# EAGLE design Controller - ESP32 Wroom - Rev. A (EAGLE 9.6.2)
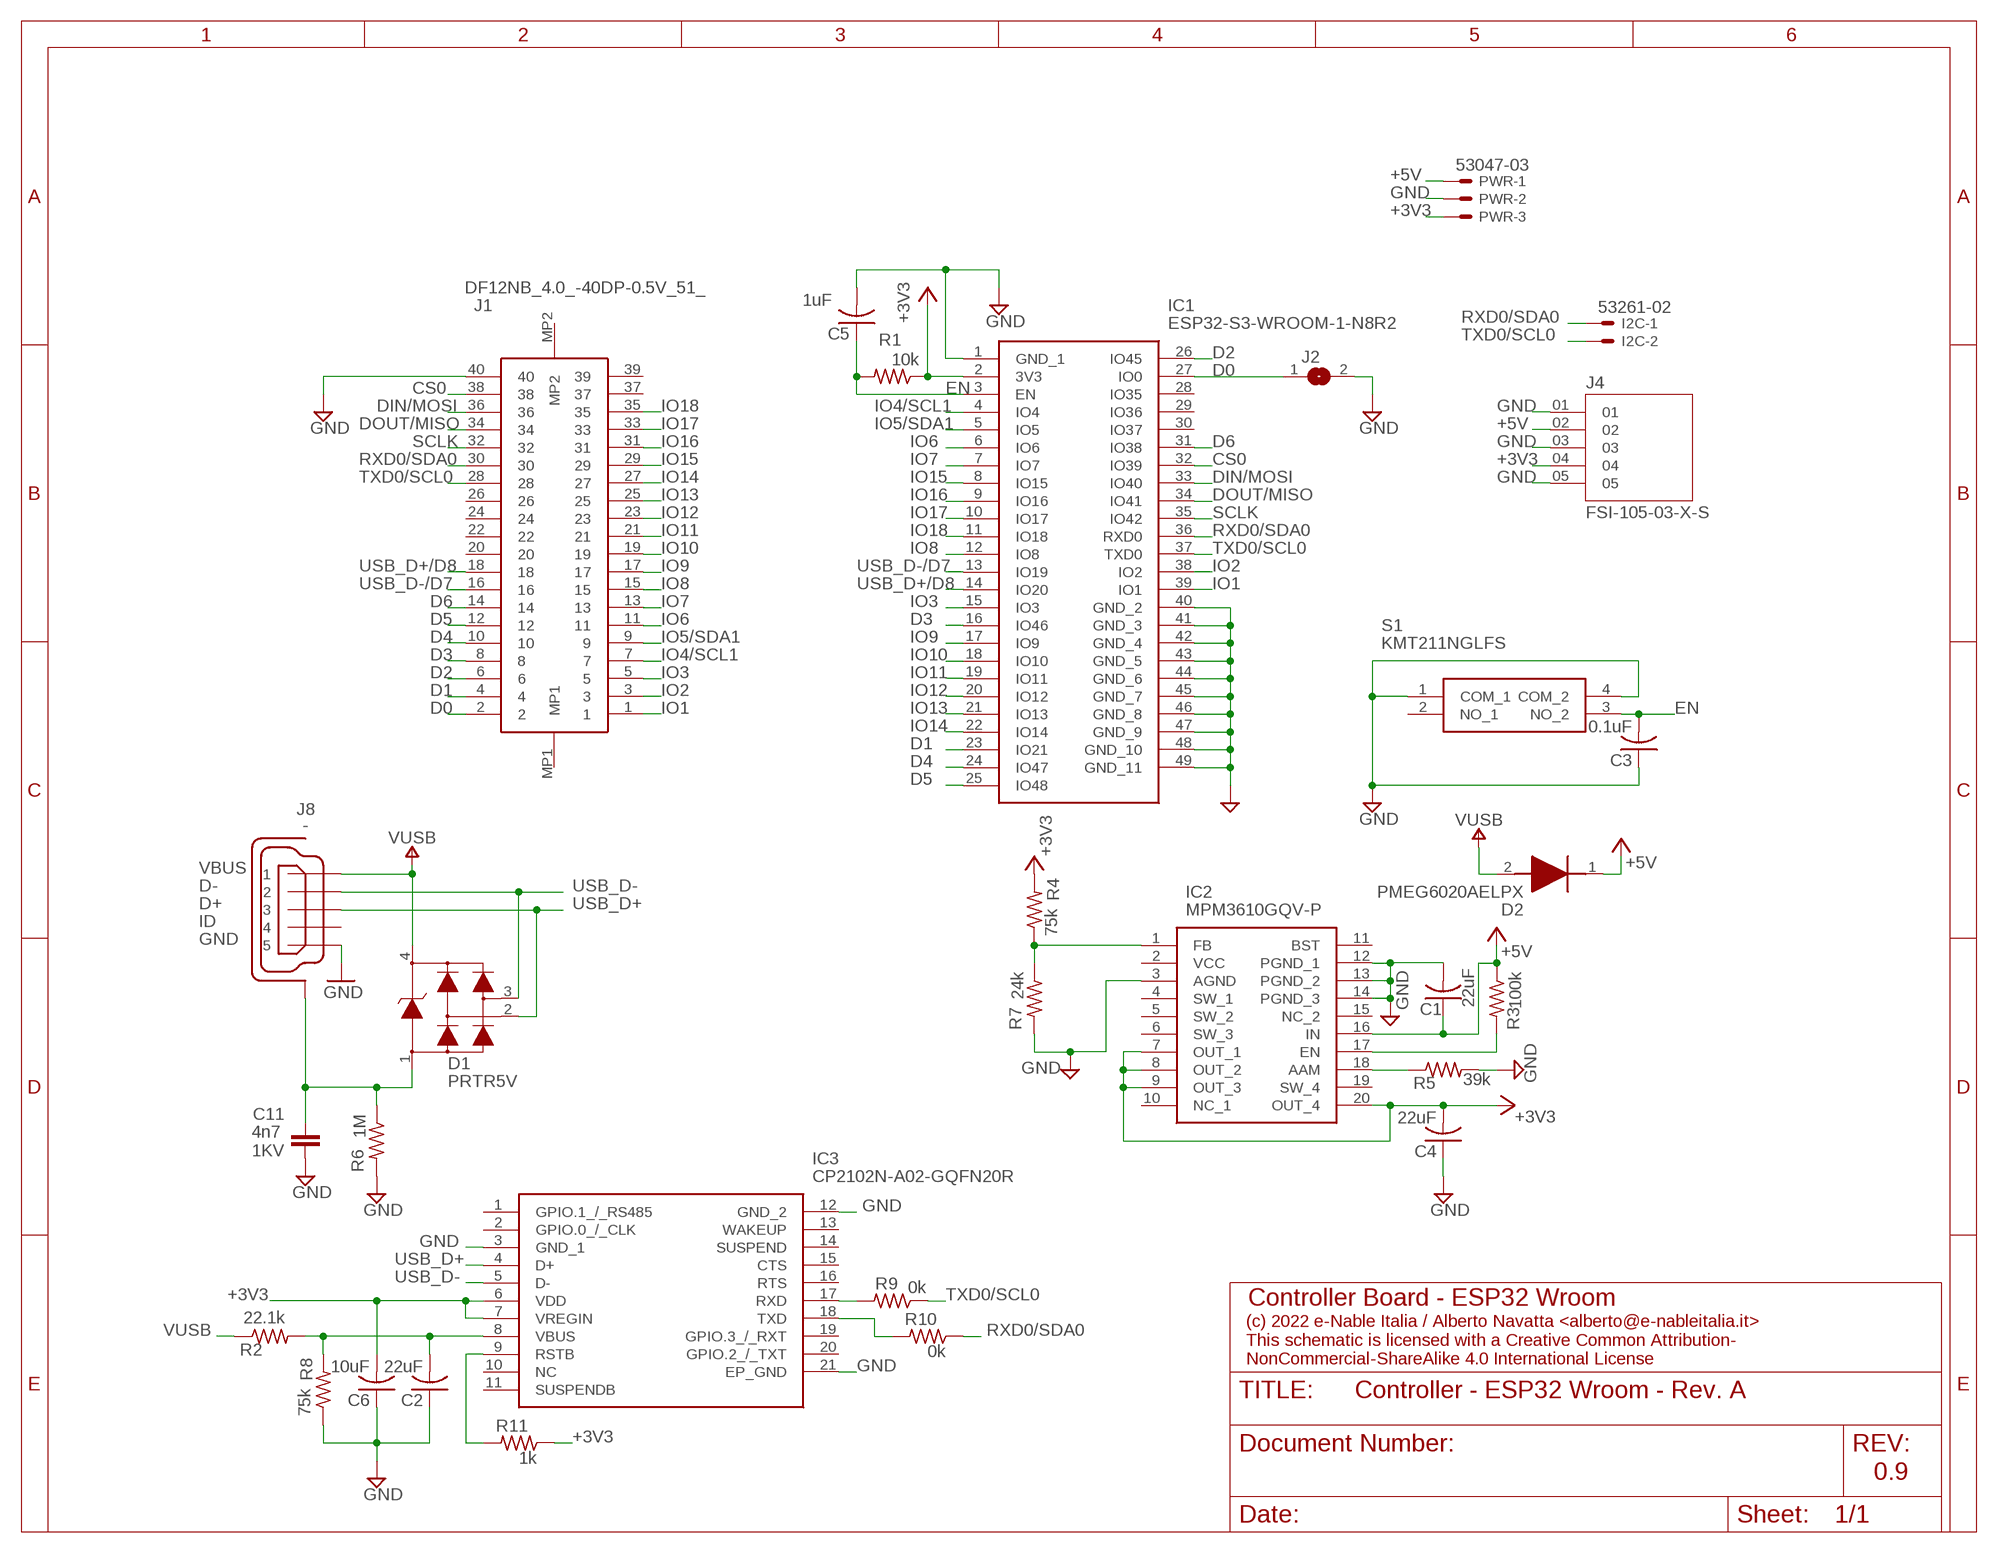
[diagram p0: schematic, sheet 1]

## Parts
C1  22uF  C-USC0603  [C0603]
C2  22uF  C-USC0402  [C0402]
C3  0.1uF  C-USC0402  [C0402]
C4  22uF  C-USC0603  [C0603]
C5  1uF  C-USC0402  [C0402]
C6  10uF  C-USC0402  [C0402]
C11  4n7  C4.7NF-0805  [0805-R2013X50N]
D1  PRTR5V  PRTR5V0U2X,215  [SOT190P230X110-4N]
D2  PMEG6020AELPX  [SODFL4725X110N]
I2C  53261-02  [53261-02]
IC1  ESP32-S3-WROOM-1-N8R2  [ESP32S3WROOM1N8R2]
IC2  MPM3610GQV-P  [MPM3610GQVP]
IC3  CP2102N-A02-GQFN20R  [CP2102NA02GQFN20]
J1  DF12NB_4.0_-40DP-0.5V_51_  [DF12NB4040DP05V51]
J2  SJ  [SJ]
J4  FSI-105-03-X-S  [SAMTEC_FSI-105-03-X-S]
J8  -  USB-MICRO  [ZX62-AB-5PA]
PWR  53047-03  [53047-03]
R1  10k  R-US_R0402  [R0402]
R2  22.1k  R-US_R0402  [R0402]
R3  100k  R-US_R0402  [R0402]
R4  75k  R-US_R0402  [R0402]
R5  39k  R-US_R0402  [R0402]
R6  1M  R-US_R0402  [R0402]
R7  24k  R-US_R0402  [R0402]
R8  75k  R-US_R0402  [R0402]
R9  0k  R-US_R0402  [R0402]
R10  0k  R-US_R0402  [R0402]
R11  1k  R-US_R0402  [R0402]
S1  KMT211NGLFS  [KMT211NGLFS]

## Nets
+3V3 [Power]: C4.2 C6.2 IC1.2(3V3) IC2.7(OUT_1) IC2.8(OUT_2) IC2.9(OUT_3) IC2.20(OUT_4) IC3.6(VDD) IC3.7(VREGIN) J4.04 PWR.3 R1.1 R4.2 R11.1
+5V [Power]: C1.1 D2.1(K) IC2.16(IN) J4.02 PWR.1 R3.1
CS0: IC1.32(IO39) J1.38
D0: IC1.27(IO0) J1.2 J2.1
D1: IC1.23(IO21) J1.4
D2: IC1.26(IO45) J1.6
D3: IC1.16(IO46) J1.8
D4: IC1.24(IO47) J1.10
D5: IC1.25(IO48) J1.12
D6: IC1.31(IO38) J1.14
DIN/MOSI: IC1.33(IO40) J1.36
DOUT/MISO: IC1.34(IO41) J1.34
EN: C3.2 C5.1 IC1.3(EN) R1.2 S1.3(NO_2)
GND [GND]: C1.2 C2.1 C3.1 C4.1 C5.2 C6.1 C11.2 IC1.1(GND_1) IC1.40(GND_2) IC1.41(GND_3) IC1.42(GND_4) IC1.43(GND_5) IC1.44(GND_6) IC1.45(GND_7) IC1.46(GND_8) IC1.47(GND_9) IC1.48(GND_10) IC1.49(GND_11) IC2.3(AGND) IC2.12(PGND_1) IC2.13(PGND_2) IC2.14(PGND_3) IC3.3(GND_1) IC3.12(GND_2) IC3.21(EP_GND) J1.40 J2.2 J4.01 J4.03 J4.05 J8.5 PWR.2 R5.2 R6.2 R7.2 R8.1 S1.1(COM_1) S1.4(COM_2)
IO1: IC1.39(IO1) J1.1
IO2: IC1.38(IO2) J1.3
IO3: IC1.15(IO3) J1.5
IO4/SCL1: IC1.4(IO4) J1.7
IO5/SDA1: IC1.5(IO5) J1.9
IO6: IC1.6(IO6) J1.11
IO7: IC1.7(IO7) J1.13
IO8: IC1.12(IO8) J1.15
IO9: IC1.17(IO9) J1.17
IO10: IC1.18(IO10) J1.19
IO11: IC1.19(IO11) J1.21
IO12: IC1.20(IO12) J1.23
IO13: IC1.21(IO13) J1.25
IO14: IC1.22(IO14) J1.27
IO15: IC1.8(IO15) J1.29
IO16: IC1.9(IO16) J1.31
IO17: IC1.10(IO17) J1.33
IO18: IC1.11(IO18) J1.35
N$1: IC2.18(AAM) R5.1
N$2: C2.2 IC3.8(VBUS) R2.2 R8.2
N$3: IC2.1(FB) R4.1 R7.1
N$4: IC2.17(EN) R3.2
N$5: IC3.17(RXD) R9.2
N$6: IC3.18(TXD) R10.2
N$7: C11.1 D1.1 J8.6(SH) J8.7(SH) J8.8(SH) J8.9(SH) J8.10(SH) J8.11(SH) R6.1
N$8: IC3.9(RSTB) R11.2
RXD0/SDA0: I2C.1 IC1.36(RXD0) J1.30 R10.1
SCLK: IC1.35(IO42) J1.32
TXD0/SCL0: I2C.2 IC1.37(TXD0) J1.28 R9.1
USB_D+: D1.2 IC3.4(D+) J8.3
USB_D+/D8: IC1.14(IO20) J1.18
USB_D-: D1.3 IC3.5(D-) J8.2
USB_D-/D7: IC1.13(IO19) J1.16
VUSB [Power]: D1.4 D2.2(A) J8.1 R2.1
Unconnected: IC1.28(IO35) IC1.29(IO36) IC1.30(IO37) IC2.2(VCC) IC2.4(SW_1) IC2.5(SW_2) IC2.6(SW_3) IC2.10(NC_1) IC2.11(BST) IC2.15(NC_2) IC2.19(SW_4) IC3.1(GPIO.1_/_RS485) IC3.2(GPIO.0_/_CLK) IC3.10(NC) IC3.11(SUSPENDB) IC3.13(WAKEUP) IC3.14(SUSPEND) IC3.15(CTS) IC3.16(RTS) IC3.19(GPIO.3_/_RXT) IC3.20(GPIO.2_/_TXT) J1.20 J1.22 J1.24 J1.26 J1.37 J1.39 J1.MP1 J1.MP2 J8.4 S1.2(NO_1)

## Notes on the sheet
- Controller Board - ESP32 Wroom
- (c) 2022 e-Nable Italia / Alberto Navatta <alberto@e-nableitalia.it>
  This schematic is licensed with a Creative Common Attribution-
  NonCommercial-ShareAlike 4.0 International License
- 0.9

## Library data of the parts
C1-C6 = rcl:C-US: CAPACITOR, American symbol; SPICEPREFIX: C
C11 = Arduino-rcl:C: SMD Capacitor; CODE-ARDUINO: 0689; DATASHEET: http://www.kemet.com/Lists/ProductCatalog/Attachments/40/KEM_C1010_X7R_HV_SMD.pdf; DISTRIBUTOR-LINK: www.kemet.com/docfinder?Partnumber=C0805C472KDRACTU; DISTRIBUTOR-PN: 399-6738-1-ND; MANUFACTURER: Kemet; MANUFACTURER-PN: C0805C472KDRACTU; NOTE: -; VOLTAGE: 1KV
D1 = Arduino-diodes:PRTR5V0U2X,215: USB ESD protection; CODE-ARDUINO: 2209; DATASHEET: http://www.nxp.com/documents/data_sheet/PRTR5V0U2X.pdf; DISTRIBUTOR-LINK: http://www.digikey.com/product-detail/en/nxp-semiconductors/PRTR5V0U2X,215/568-4140-1-ND/1589981; DISTRIBUTOR-PN: 568-4140-1-ND; MANUFACTURER: NXP; MANUFACTURER-PN: PRTR5V0U2X,215
D2 = SamacSys_Parts:PMEG6020AELPX: NEXPERIA - PMEG6020AELPX - Schottky Rectifier, 60 V, 2 A, Single, SOD-128, 2 Pins, 670 mV Source: Datasheet <https://ms.componentsearchengine.com/Datasheets/2/PMEG6020AELPX.pdf>; DESCRIPTION: NEXPERIA - PMEG6020AELPX - Schottky Rectifier, 60 V, 2 A, Single, SOD-128, 2 Pins, 670 mV; HEIGHT: 1.1mm; MANUFACTURER_NAME: Nexperia; MANUFACTURER_PART_NUMBER: PMEG6020AELPX; MOUSER_PART_NUMBER: 771-PMEG6020AELPX; MOUSER_PRICE-STOCK: https://www.mouser.co.uk/ProductDetail/Nexperia/PMEG6020AELPX?qs=bel5lzaZNxQeOe%2FrOz5yeQ%3D%3D
I2C = con-molex:53?-02: CONNECTOR wire to board 1.25 mm (.049 inch) pitch header; MF: MOLEX; OC_FARNELL: 1125373; OC_NEWARK: unknown
IC1 = SamacSys_Parts:ESP32-S3-WROOM-1-N8R2: WiFi Modules - 802.11 (Engineering Samples Only) SMD Module, ESP32-S3R2, 2 MB PSRAM, 8 MB SPI Flash, PCB Antenna ,, Source: Datasheet; DESCRIPTION: WiFi Modules - 802.11 (Engineering Samples Only) SMD Module, ESP32-S3R2, 2 MB PSRAM, 8 MB SPI Flash, PCB Antenna ,,; HEIGHT: 3.25mm; MANUFACTURER_NAME: Espressif Systems; MANUFACTURER_PART_NUMBER: ESP32-S3-WROOM-1-N8R2; MOUSER_PART_NUMBER: 356-ESP32-S3WRM1N8R2; MOUSER_PRICE-STOCK: https://www.mouser.co.uk/ProductDetail/Espressif-Systems/ESP32-S3-WROOM-1-N8R2?qs=Wj%2FVkw3K%252BMCC1Ha9x85iJA%3D%3D
IC2 = SamacSys_Parts:MPM3610GQV-P: Switching Voltage Regulators 24V/1A DC/DC Mini- Module Reg w Inductr Source: Datasheet <https://componentsearchengine.com/Datasheets/1/MPM3610GQV-P.pdf>; DESCRIPTION: Switching Voltage Regulators 24V/1A DC/DC Mini- Module Reg w Inductr; HEIGHT: 1.65mm; MANUFACTURER_NAME: Monolithic Power Systems (MPS); MANUFACTURER_PART_NUMBER: MPM3610GQV-P; MOUSER_PART_NUMBER: 946-MPM3610GQV-P; MOUSER_PRICE-STOCK: https://www.mouser.co.uk/ProductDetail/Monolithic-Power-Systems-MPS/MPM3610GQV-P?qs=uA8e7uFv8Fj%2FtQLBFM6HcA%3D%3D
IC3 = SamacSys_Parts:CP2102N-A02-GQFN20R: Full Speed USB to UART Bridge USB 2.0 3.3V T/R Automotive 20-Pin QFN EP Source: Datasheet <https://www.silabs.com/documents/public/data-sheets/cp2102n-datasheet.pdf>; DESCRIPTION: Full Speed USB to UART Bridge USB 2.0 3.3V T/R Automotive 20-Pin QFN EP; HEIGHT: 0.8mm; MANUFACTURER_NAME: Silicon Labs; MANUFACTURER_PART_NUMBER: CP2102N-A02-GQFN20R; MOUSER_PART_NUMBER: 634-CP2102NA02QFN20R; MOUSER_PRICE-STOCK: https://www.mouser.co.uk/ProductDetail/Silicon-Labs/CP2102N-A02-GQFN20R?qs=u16ybLDytRbf2uwPkMBdUg%3D%3D
J1 = SamacSys_Parts:DF12NB_4.0_-40DP-0.5V_51_: Board to!! Board !! & Mezzanine Connectors CONN HDR 40POS SMD G Source: Datasheet <https://www.hirose.com/en/product/document?clcode=CL0537-0596-0-51&productname=DF12NB(4.0)-40DP-0.5V(51)&series=DF12N&documenttype=2DDrawing&lang=en&documentid=0001367371>; DESCRIPTION: Board to!! Board !! & Mezzanine Connectors CONN HDR 40POS SMD G; HEIGHT: 3.5mm; MANUFACTURER_NAME: Hirose; MANUFACTURER_PART_NUMBER: DF12NB(4.0)-40DP-0.5V(51); MOUSER_PART_NUMBER: 798-DF12NB4040DP0551; MOUSER_PRICE-STOCK: https://www.mouser.co.uk/ProductDetail/Hirose-Connector/DF12NB4.0-40DP-0.5V51?qs=DPoM0jnrROUKZpllIjGjYw%3D%3D
J2 = jumper:SJ: SMD solder JUMPER
J4 = FSI-105-03-X-S:FSI-105-03-X-S: 1mm SINGLE ELEMENT INTERFACE Check availability <https://pricing.snapeda.com/parts/FSI-105-03-G-S/Samtec/view-part?ref=eda>; AVAILABILITY: In Stock; DESCRIPTION: 5 Position Connector Stacking Compression Surface Mount Gold; MF: Samtec; MP: FSI-105-03-G-S; PACKAGE: None; PRICE: None; PURCHASE-URL: https://pricing.snapeda.com/search/part/FSI-105-03-G-S/?ref=eda
J8 = Arduino-connectors:USB-MICRO: USB - micro AB USB 2.0 Receptacle Connector 5 Position Surface Mount, Right Angle, Horizontal; CODE-ARDUINO: 2219; DATASHEET: https://www.hirose.com/product/en/download_file/key_name/ZX/category/Catalog/doc_file_id/31704/?file_category_id=4&item_id=13&is_series=1; DISTRIBUTOR-LINK: http://www.digikey.com/product-detail/en/hirose-electric-co-ltd/ZX62-AB-5PA(31)/H125279CT-ND/5994741; DISTRIBUTOR-PN: H125279CT-ND; MANUFACTURER: Hirose; MANUFACTURER-PN: ZX62-AB-5PA(31)
PWR = con-molex:53?-03: CONNECTOR wire to board 1.25 mm (.049 inch) pitch header; MF: MOLEX; MPN: 530470310; OC_FARNELL: 9732853; OC_NEWARK: 14R5412
R1-R11 = rcl:R-US_: RESISTOR, American symbol; SPICEPREFIX: R
S1 = SamacSys_Parts:KMT211NGLFS: Tactile Switches SPST N.O. GULLWING FOR SMT Source: Datasheet <https://www.ckswitches.com/media/1455/kmt2.pdf>; DESCRIPTION: Tactile Switches SPST N.O. GULLWING FOR SMT; HEIGHT: 0.8mm; MANUFACTURER_NAME: C & K COMPONENTS; MANUFACTURER_PART_NUMBER: KMT211NGLFS; MOUSER_PART_NUMBER: 611-KMT211NGLFS; MOUSER_PRICE-STOCK: https://www.mouser.co.uk/ProductDetail/CK/KMT211NGLFS?qs=hvk6vzacGVhmRxqfjOQwQg%3D%3D

## Net classes
2 Power: width 0.203 mm

## Board
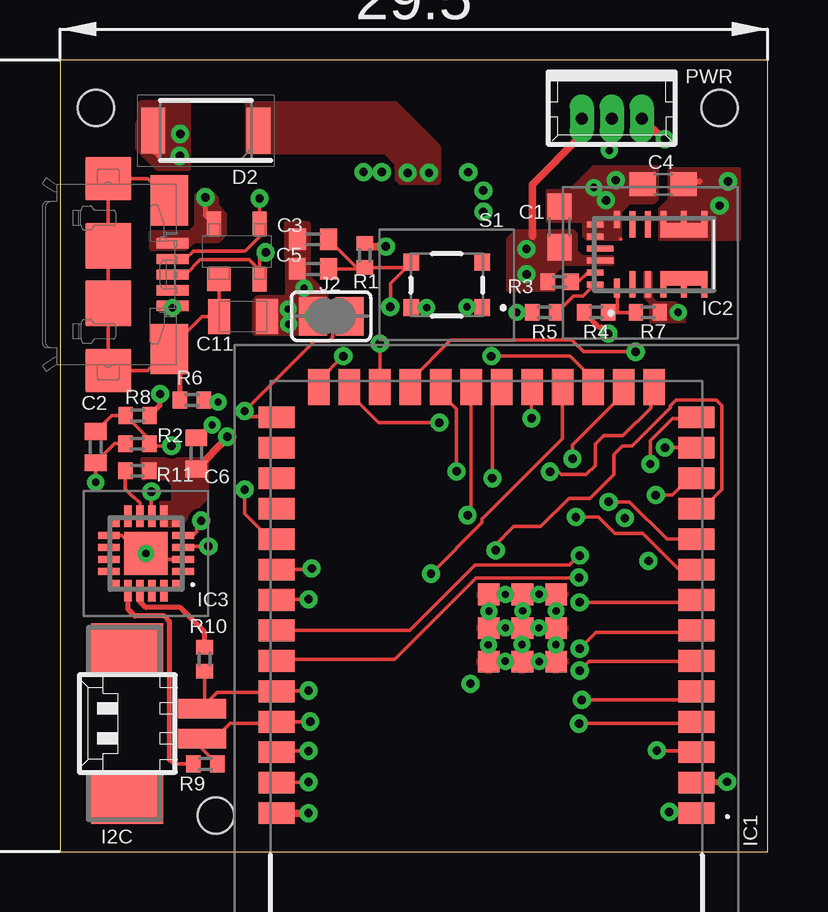
[diagram p1: board, top side]
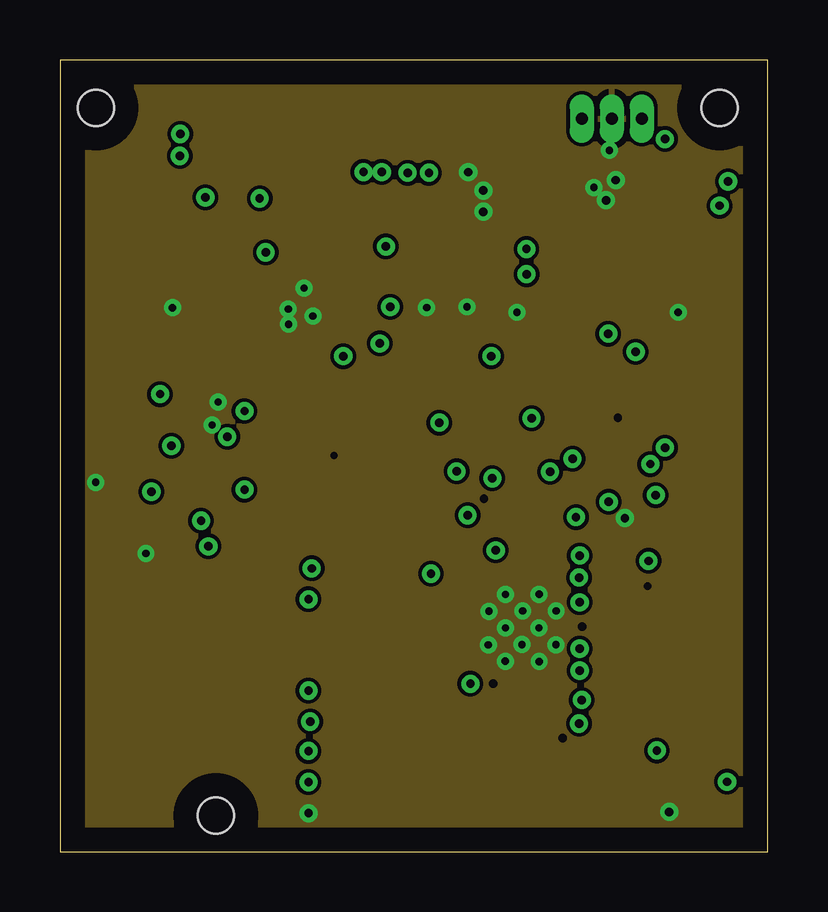
[diagram p2: board, inner layer Route2]
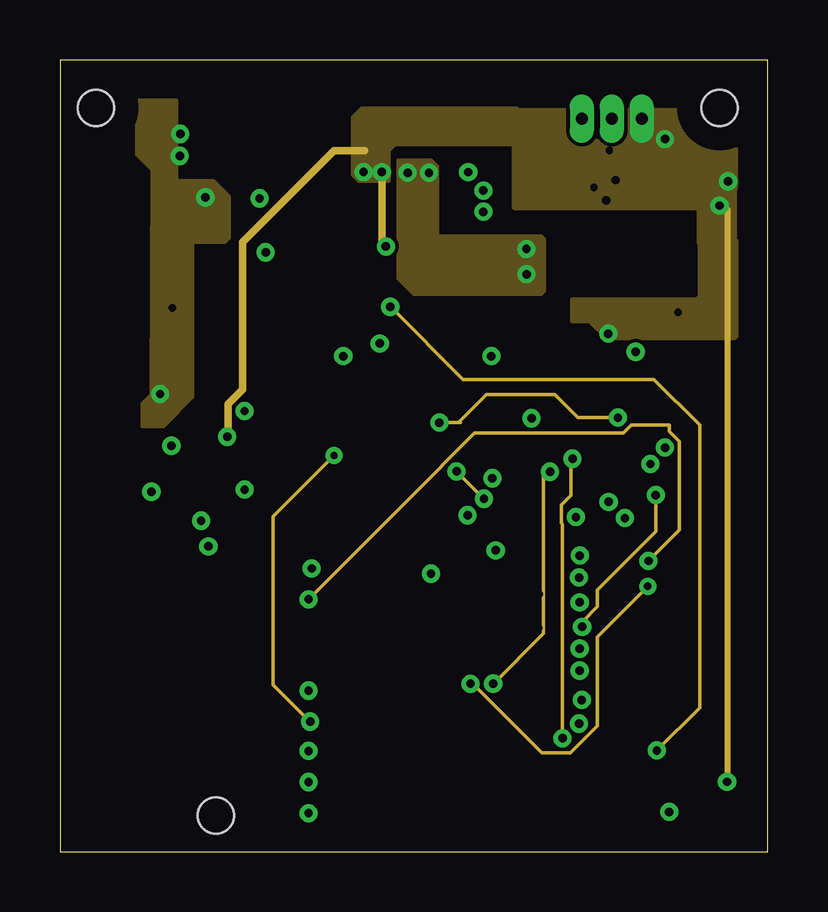
[diagram p3: board, inner layer Route15]
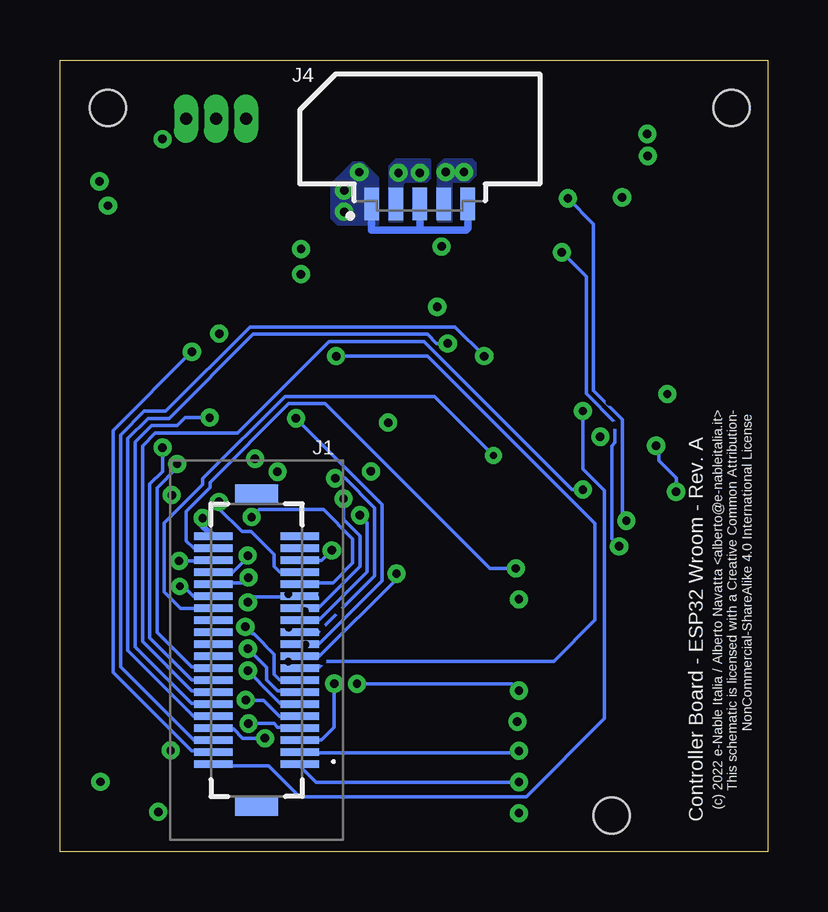
[diagram p4: board, bottom side, seen from below]

Size 29.5 x 33 mm. Coordinates in mm from the lower left corner, seen from the top.
Outline: 0,0 29.5,0 29.5,33 0,33 0,0
Copper layers ([2:1+(2*15)+16:15]): Top 0.035mm / dielectric 0.11mm / Route2 0.035mm / dielectric 0.8mm / Route15 0.035mm / dielectric 0.11mm / Bottom 0.035mm
Design rules "default *": minimum track width 6mil, minimum drill 0.35mm, track to track 6mil, track to pad 6mil, pad to pad 6mil, via to via 6mil, smd to smd 6mil, copper to edge 40mil, drill to drill 6mil, minimum pad ring 10mil, minimum via ring 8mil, stop-mask expansion 4mil, vias tented up to drill 0mil, thermal gap 10mil
Holes 1.5 mm at 1.5,31 27.5,31 6.5,1.5

### Footprints (pad centres in the part's own frame; a part is rotated, then mirrored left to right if it is on the bottom)
C0603 = smd 1.1 x 1: 1 -0.85,0; 2 0.85,0
C0402 = smd 0.7 x 0.9: 1 -0.65,0; 2 0.65,0
0805-R2013X50N = smd 0.95 x 1.45: 1 -1,0; 2 1,0
SOT190P230X110-4N = smd 1 x 1: 1 -1.15,0.75 | smd 1 x 0.6: 2 -1.15,-0.95; 3 1.15,-0.95; 4 1.15,0.95
SODFL4725X110N = smd 1 x 1.93: 1 -2.2,0; 2 2.2,0
53261-02 = smd 0.8 x 2: 1 0.625,-2.5; 2 -0.625,-2.5 | smd 2.1 x 3: S1 3.125,0.625; S2 -3.125,0.625
ESP32S3WROOM1N8R2 = smd 1.5 x 0.9: 1 -8.75,5.26; 2 -8.75,3.99; 3 -8.75,2.72; 4 -8.75,1.45; 5 -8.75,0.18; 6 -8.75,-1.09; 7 -8.75,-2.36; 8 -8.75,-3.63; 9 -8.75,-4.9; 10 -8.75,-6.17; 11 -8.75,-7.44; 12 -8.75,-8.71; 13 -8.75,-9.98; 14 -8.75,-11.25; 27 8.75,-11.25; 28 8.75,-9.98; 29 8.75,-8.71; 30 8.75,-7.44; 31 8.75,-6.17; 32 8.75,-4.9; 33 8.75,-3.63; 34 8.75,-2.36; 35 8.75,-1.09; 36 8.75,0.18; 37 8.75,1.45; 38 8.75,2.72; 39 8.75,3.99; 40 8.75,5.26 | smd 0.9 x 1.5: 15 -6.985,-12.5; 16 -5.715,-12.5; 17 -4.445,-12.5; 18 -3.175,-12.5; 19 -1.905,-12.5; 20 -0.635,-12.5; 21 0.635,-12.5; 22 1.905,-12.5; 23 3.175,-12.5; 24 4.445,-12.5; 25 5.715,-12.5; 26 6.985,-12.5 | smd 0.9 x 0.9: 41 -1.5,-2.46; 42 -1.5,-1.06; 43 -2.9,-1.06; 44 -2.9,-2.46; 45 -2.9,-3.86; 46 -1.5,-3.86; 47 -0.1,-3.86; 48 -0.1,-2.46; 49 -0.1,-1.06
MPM3610GQVP = smd 0.8 x 0.25: 1 -1.4,1.55 | smd 1.1 x 0.25: 2 -1.25,0.9; 3 -1.25,0.25; 10 1.25,0.25; 11 1.25,0.9 | smd 0.5 x 0.25: 4 -1.55,-0.4; 5 -1.55,-1.25; 6 -1.55,-2.1; 7 1.55,-2.1; 8 1.55,-1.25; 9 1.55,-0.4 | smd 0.7 x 0.25: 12 1.45,1.55 | smd 0.25 x 0.7: 13 1.25,2.45; 14 0.75,2.45; 17 -0.75,2.45; 18 -1.25,2.45 | smd 0.25 x 1.1: 15 0.25,2.25; 16 -0.25,2.25 | smd 0.6 x 1.95: 19 -1,-1.25; 20 1,-1.25
CP2102NA02GQFN20 = smd 0.3 x 0.3: 1 -1.25,1.25; 6 -1.25,-1.25; 11 1.25,-1.25; 16 1.25,1.25 | smd 0.9 x 0.3: 2 -1.55,0.75; 3 -1.55,0.25; 4 -1.55,-0.25; 5 -1.55,-0.75; 12 1.55,-0.75; 13 1.55,-0.25; 14 1.55,0.25; 15 1.55,0.75 | smd 0.3 x 0.9: 7 -0.75,-1.55; 8 -0.25,-1.55; 9 0.25,-1.55; 10 0.75,-1.55; 17 0.75,1.55; 18 0.25,1.55; 19 -0.25,1.55; 20 -0.75,1.55 | smd 1.8 x 1.8: 21 0,0
DF12NB4040DP05V51 = smd 0.3 x 1.6: 1 -4.75,-1.8; 2 -4.75,1.8; 3 -4.25,-1.8; 4 -4.25,1.8; 5 -3.75,-1.8; 6 -3.75,1.8; 7 -3.25,-1.8; 8 -3.25,1.8; 9 -2.75,-1.8; 10 -2.75,1.8; 11 -2.25,-1.8; 12 -2.25,1.8; 13 -1.75,-1.8; 14 -1.75,1.8; 15 -1.25,-1.8; 16 -1.25,1.8; 17 -0.75,-1.8; 18 -0.75,1.8; 19 -0.25,-1.8; 20 -0.25,1.8; 21 0.25,-1.8; 22 0.25,1.8; 23 0.75,-1.8; 24 0.75,1.8; 25 1.25,-1.8; 26 1.25,1.8; 27 1.75,-1.8; 28 1.75,1.8; 29 2.25,-1.8; 30 2.25,1.8; 31 2.75,-1.8; 32 2.75,1.8; 33 3.25,-1.8; 34 3.25,1.8; 35 3.75,-1.8; 36 3.75,1.8; 37 4.25,-1.8; 38 4.25,1.8; 39 4.75,-1.8; 40 4.75,1.8 | smd 0.8 x 1.8: MP1 -6.5,0; MP2 6.5,0
SJ = smd 1.168 x 1.6: 1 -0.762,0; 2 0.762,0
SAMTEC_FSI-105-03-X-S = smd 0.6 x 1.35: 01 -2,0; 02 -1,0; 03 0,0; 04 1,0; 05 2,0
ZX62-AB-5PA = smd 0.4 x 1.35: 1 -1.3,3.025; 2 -0.65,3.025; 3 0,3.025; 4 0.65,3.025; 5 1.3,3.025 | smd 2.1 x 1.6: 6 3.1,2.9; 11 -3.1,2.9 | smd 1.8 x 1.9: 7 4,0.35; 10 -4,0.35 | smd 1.9 x 1.9: 8 1.2,0.35; 9 -1.2,0.35
53047-03 = drill 0.5 pad 0.698 long: 1 1.25,0.45; 2 0,0.45; 3 -1.25,0.45
R0402 = smd 0.6 x 0.7: 1 -0.5,0; 2 0.5,0
KMT211NGLFS = smd 0.65 x 0.7: 1 -1.475,0.95; 2 -1.475,-0.95; 3 1.475,-0.95; 4 1.475,0.95

### Placement (x,y rotation side)
C1  20.83,26.04 90 top
C2  1.49,16.86 90 top
C3  10.55,25.52 0 top
C4  25.15,27.81 0 top
C5  10.55,24.28 180 top
C6  5.69,16.6 270 top
C11  7.63,22.3 0 top
D1  7.38,25.01 90 top
D2  6.08,30.05 180 top
I2C  3.43,5.33 90 top
IC1  17.78,6.86 180 top
IC2  24.77,24.89 90 top
IC3  3.58,12.43 180 top
J1  21.3,8.4 90 bottom
J2  11.31,22.32 180 top
J4  14.5,27 0 bottom
J8  1.67,24.05 270 top
PWR  23,31 180 top
R1  12.71,24.85 270 top
R2  3.24,18.17 180 top
R3  20.83,23.75 0 top
R4  22.35,22.48 180 top
R5  20.19,22.48 180 top
R6  5.51,18.83 0 top
R7  24.51,22.48 0 top
R8  3.22,17 0 top
R9  6.06,3.65 180 top
R10  6.03,8.02 90 top
R11  3.23,15.88 180 top
S1  16.13,23.62 180 top

### Tracks (layer width: path | path; a pad name or v marks a point on that pad's centre or on a via)
+3V3  (via drill 0.35, 0.35 pad 0.18)
  Top 0.203: 26.52,2.9 IC1.2 | v22.86,21.59 22.57,21.88 22.45,21.88 22.3,22.02 22.3,22.03 R4.2
  Top 0.254: IC1.2 26.57,2.91 v27.82,2.91 | C4.2 26.12,27.94 26.67,27.94
  Top 0.305: 12.87,25.51 R1.1 12.84,25.23 v13.59,25.23 | PWR.3 25.18,29.7 v25.22,29.7 | v6.97,17.3 6.97,17.23 C6.2
  Route15 0.254: 27.81,26.8 v27.81,2.91 v27.82,2.91
  Route15 0.305: v6.97,17.3 7.01,17.34 7.01,18.65 7.62,19.25 7.62,25.4 11.43,29.21 12.7,29.21 | v13.42,28.33 13.42,25.4 v13.59,25.23
  other vias: 27.85,27.94 27.5,26.93 12.66,28.33
  pour Top (no thermals): 25.4,28.45 25.4,27.18 25.02,26.8 25.02,25.53 28.32,25.53 28.32,28.45
  pour Route15 (no thermals): 18.96,30.91 27.57,30.91 28.16,30.32 28.16,27.65 27.34,26.83 18.96,26.83
  pour Route15 (no thermals): 26.67,27.94 28.1,27.94 28.1,25.4 26.67,25.4
  pour Route15 (no thermals): 26.65,25.4 26.65,23.16 26.59,23.1 26.52,23.03 21.35,23.03 21.35,22.1 22.07,22.1 22.79,21.38 28.13,21.38 28.25,21.5 28.22,21.53 28.22,25.49
  pour Top (no thermals): 3.43,16.37 6.09,16.37 6.13,16.33 6.13,14.73 5.11,13.72 5.09,13.69 4.72,13.69 4.72,15.27 4.53,15.46 4.44,15.55 3.44,15.55
  pour Top (no thermals): 4.19,14.55 5.11,14.55 5.11,14.55 5.11,13.57 4.3,13.57 4.16,13.72 4.16,14.1 4.15,14.11
  pour Bottom (no thermals): 13.21,27.94 13.21,26.29 13.72,26.29 13.72,28.57 13.46,28.83 12.32,28.83 12.19,28.7 12.19,28.19 12.45,27.94
  pour Route15 (no thermals): 12.45,27.94 13.72,27.94 13.72,29.21 13.97,29.46 19.05,29.46 19.05,30.99 12.57,30.99 12.19,30.61 12.19,28.19
+5V  (via drill 0.35)
  Top 0.305: PWR.1 21.66,29.77 19.69,27.8 19.69,25.66
  other vias: 19.45,25.12 19.45,24.07 14.49,28.3 15.38,28.3
  pour Top (no thermals): 19.01,25.86 21.42,25.86 21.52,25.76 21.52,25.03 21.75,24.8 23.03,24.8 23.05,24.79 23.05,24.51 23.03,24.49 20.99,24.49 20.59,24.09 20.59,23.42 18.68,23.42 18.68,25.54
  pour Route15 (no thermals): 20.19,23.37 20.07,23.24 14.73,23.24 14.1,23.88 14.1,28.83 15.49,28.83 15.75,28.57 15.75,25.65 20.07,25.65 20.19,25.53
  pour Bottom (no thermals): 14.1,28.07 14.22,27.94 14.86,27.94 15.11,27.94 15.24,27.81 15.24,27.69 15.24,26.29 15.75,26.29 15.75,28.57 15.49,28.83 14.1,28.83
  pour Top (no thermals): 7.87,31.11 13.97,31.11 15.75,29.34 15.75,27.94 14.22,27.94 14.1,28.07 14.1,28.7 13.59,29.21 13.21,29.21 7.87,29.21
CS0  (via drill 0.35)
  Top 0.152: 8.99,11.81 IC1.32 10.45,11.76 v10.49,11.8
  Bottom 0.152: J1.38 23.16,12.65 23.93,12.65 24.23,12.95 24.23,14.18 23.24,15.17 23.24,15.39 19.96,18.67 18.44,18.67 11.57,11.79 v10.49,11.79 v10.49,11.8
D0  (via drill 0.35)
  Top 0.152: IC1.27 8.99,18.14 7.92,18.14 v7.7,18.36 10.62,21.29 11.22,21.29 11.36,21.42 11.36,21.61 J2.1
  Bottom 0.152: J1.2 23.09,3.58 20.8,3.58 19.51,2.29 10.06,2.29 6.8,5.55 6.8,15.05 7.7,15.95 v7.7,18.36
D1  (via drill 0.35)
  Top 0.152: v24,20.84 21.83,20.84 21.35,21.31 16.29,21.31 14.63,19.66 14.63,19.43 IC1.23
  Bottom 0.152: v24,20.84 27.28,17.56 27.28,7.47 24,4.19 23.16,4.19 J1.4
D2  (via drill 0.35)
  Top 0.152: v11.81,20.65 10.82,19.66 10.82,19.43 IC1.26
  Bottom 0.152: v11.81,20.65 13.03,21.87 21.58,21.87 25.09,18.36 25.98,18.36 26.98,17.37 26.98,7.7 23.93,4.65 23.16,4.65 J1.6
D3  (via drill 0.35, 0.35 layers 15-16)
  Top 0.152: v21.37,16.37 21.37,16.95 23.47,19.05 23.47,19.36 IC1.16
  Route15 0.152: v21.37,16.37 21.3,16.3 21.3,14.84 20.91,14.45 20.91,13.69 20.95,13.64 v20.95,4.72
  Bottom 0.152: J1.8 23.09,5.11 22.27,5.11 21.89,4.73 v20.96,4.73 v20.95,4.72
D4  (via drill 0.35)
  Top 0.152: v13.34,21.18 IC1.24
  Bottom 0.152: v13.34,21.18 13.79,21.18 14.17,21.57 21.45,21.57 24.95,18.06 25.83,18.06 26.67,17.22 26.67,8.38 23.93,5.64 23.16,5.64 J1.10
D5  (via drill 0.35, 0.35 layers 15-16)
  Top 0.152: 15.81,17.89 v15.82,17.88 13.29,17.88 12.12,19.05 12.12,19.36 IC1.25
  Route15 0.152: v23.26,18.09 21.59,18.09 20.63,19.05 17.78,19.05 16.61,17.88 | 16.69,17.88 16.61,17.88 | v15.82,17.88 16.51,17.88 16.61,17.88
  Bottom 0.152: v23.26,18.09 24.28,18.09 24.61,17.75 25.68,17.75 26.36,17.07 26.36,8.53 24,6.17 23.16,6.17 J1.12
D6  (via drill 0.35)
  Top 0.152: v7.7,15.09 7.7,14.1 8.76,13.03 8.99,13.03 IC1.31
  Bottom 0.152: v7.7,15.09 8.15,15.09 14.33,21.26 18.29,21.26 22.1,17.45 25.53,17.45 26.06,16.92 26.06,8.76 24,6.71 23.16,6.71 J1.14
DIN/MOSI  (via drill 0.35)
  Top 0.152: 8.99,10.52 IC1.33 9.07,10.52 v10.36,10.52
  Route15 0.152: v10.36,10.52 15.93,16.08 15.93,16.1 17.28,17.45 23.49,17.45 23.81,17.78 25.4,17.78 25.4,17.52 25.83,17.09 25.83,13.41 v24.54,12.12
  Bottom 0.152: J1.36 23.16,12.12 v24.54,12.12
DOUT/MISO  (via drill 0.35)
  Top 0.152: IC1.34 9.07,9.22 14.57,9.22 17.3,11.95 21.24,11.95 21.64,12.34 v21.67,12.34
  Bottom 0.152: 22.33,11.66 23.09,11.66 J1.34 22.3,11.63 21.67,12.26 v21.67,12.34
EN  (via drill 0.35)
  Top 0.152: 14.63,24.54 S1.3 | IC1.3 26.52,4.19 25.07,4.19 25.06,4.17 24.93,4.17 v24.89,4.21 | 14.63,24.54 14.4,24.54 | 11.02,24.29 C5.1 12.64,24.29 R1.2 | R1.2 14.45,24.35 | 14.45,24.35 14.63,24.54 | C3.2 12.37,24.35 R1.2 | v13.77,22.71 13.77,23.68 14.45,24.35
  Route15 0.152: v13.77,22.71 16.8,19.68 24.77,19.68 26.67,17.78 26.67,6 v24.89,4.21
GND  (via drill 0.3 layers 1-2, 0.3 pad 0.18 layers 1-2, 0.35, 0.35 layers 1-2)
  Top 0.152: 17.91,7.92 IC1.49 17.98,7.92 | 20.65,7.92 IC1.43 | 19.36,7.92 IC1.42 | 20.73,9.37 IC1.44 20.65,9.37 | 20.73,10.67 IC1.45 | 19.28,9.37 IC1.41 19.36,9.37 | 19.28,10.67 IC1.46 19.2,10.67 | 17.91,9.37 IC1.48 | 17.91,10.59 IC1.47 v18.57,10.72 v18.58,10.72 | S1.1 17.68,22.63 17.83,22.48 | 9.07,1.6 IC1.40 | IC1.1 26.52,1.6 | 10.36,1.52 v10.36,1.6 | 23.39,25.53 23.37,25.53 | v1.49,15.39 C2.1 2.29,17 R8.1 | v1.49,15.39 | C6.1 6.22,17.78 v6.35,17.78 | R6.2 6.51,18.83 v6.59,18.75 | J8.5 v4.69,22.67 | IC3.3 4.84,12.17 3.84,12.17 IC3.21 3.33,12.43 2.58,13.18 IC3.12
  Top 0.203: v16.96,22.71 v16.97,22.71 | S1.1 17.57,22.71 | C11.2 8.68,22.25 | J2.2 10.48,22.25
  Top 0.254: IC1.42 | IC1.48 17.91,9.3 | 17.57,22.71 v16.97,22.71 | S1.4 v15.29,22.67 | R5.2 v19.06,22.48
  Top 0.305: v10.36,1.6 9.07,1.6 | PWR.2 v22.9,29.23 | 26.52,1.6 26.47,1.65 v25.4,1.65
  Bottom 0.254: J1.40 23.55,13.55 v23.55,13.9
  Bottom 0.305: J4.03 14.5,26.01 14.61,25.91 | 14.61,25.91 16.51,25.91 J4.01 | J4.05 12.5,25.98 12.57,25.91 14.61,25.91
  other vias: 23.17,27.99 22.76,27.15 22.26,27.69 19.98,10.73 20.69,10.03 19.29,10.03 17.89,10.02 19.97,9.32 18.57,9.32 20.68,8.62 19.27,8.63 17.86,8.62 18.57,7.93 19.98,7.92 25.77,22.48 10.55,22.32 9.53,21.98 10.18,23.49 9.52,22.61 3.58,12.43 17.65,26.67 17.65,27.56 17.02,28.32
  pour Top (no thermals): 20.33,27.56 21.27,27.56 22.24,28.53 24.89,28.53 24.89,27.18 24.77,27.05 23.75,27.05 23.37,26.67 23.37,25.53 21.97,25.53 21.84,25.65 21.84,26.29 20.33,26.29
  pour Top (no thermals): 24.38,24.13 24.38,23.11 24.64,22.86 24.64,22.1 26.04,22.1 26.04,22.48 25.65,22.86 24.89,22.86 24.64,23.11 24.64,24.13
  pour Route2: 0.57,0.53 28.4,0.53 28.78,0.91 28.78,32.62 0.46,32.54
  pour Top: 17.45,11.17 21.12,11.17 21.15,11.13 21.15,7.49 17.5,7.45 17.44,7.51 17.44,10.67 17.49,10.73
  pour Top: 17.45,11.15 21.08,11.15 21.16,11.06 21.16,7.48 17.55,7.48 17.45,7.48 17.44,7.5
  pour Top (no thermals): 9.45,26.19 10.33,26.19 10.35,26.16 10.35,23.94 11.07,23.23 11.07,21.69 10.96,21.58 8.15,21.58 8.12,21.61 8.12,22.97 8.13,22.98 8.27,23.11 9.39,23.11 9.51,23.23 9.51,23.25
  pour Bottom (no thermals): 16.51,28.32 16.89,28.7 17.27,28.7 18.16,27.81 18.16,26.42 17.91,26.16 16.26,26.16 16.26,28.07
IO1  (via drill 0.35)
  Top 0.152: v10.36,2.9 9.07,2.9 IC1.39
  Bottom 0.152: v10.36,2.9 18.82,2.9 19.51,3.58 J1.1
IO2  (via drill 0.35)
  Top 0.152: v10.36,4.19 9.07,4.19 IC1.38
  Bottom 0.152: v10.36,4.19 10.43,4.12 19.53,4.12 J1.3
IO3  (via drill 0.35, 0.35 layers 15-16)
  Top 0.152: 24.77,19.05 IC1.15 24.62,19.22 24.62,18.49 23.47,17.34 22.67,17.34 22.32,16.98 22.32,16.1 21.92,15.71 20.91,15.71 20.78,15.83 v20.43,15.83
  Route15 0.152: v20.43,15.83 20.32,15.83 20.15,15.66 20.15,9.09 v18.06,7
  Bottom 0.152: J1.5 18.59,4.65 18.06,5.18 v18.06,7
IO4/SCL1  (via drill 0.35)
  Top 0.152: v21.64,5.33 26.52,5.33 IC1.4
  Bottom 0.152: v21.64,5.33 20.57,5.33 20.42,5.18 19.58,5.18 J1.7
IO5/SDA1  (via drill 0.35)
  Top 0.152: v21.76,6.32 26.44,6.32 IC1.5
  Bottom 0.152: v21.76,6.32 21.74,6.3 21.01,6.3 20.34,5.64 19.58,5.64 J1.9
IO6  (via drill 0.35)
  Top 0.152: v21.67,7.54 22.05,7.92 26.52,7.92 IC1.6
  Bottom 0.152: J1.11 19.58,6.17 20.32,6.17 21.18,7.04 21.18,7.06 v21.67,7.54
IO7  (via drill 0.35)
  Top 0.152: v21.67,8.46 22.35,9.14 26.52,9.14 IC1.7
  Bottom 0.152: v21.67,8.46 20.88,7.67 20.88,7.16 20.42,6.71 19.58,6.71 J1.13
IO8  (via drill 0.35, 0.35 layers 15-16)
  Top 0.152: v24.84,14.86 25.53,14.86 26.21,15.54 26.52,15.54 IC1.12
  Route15 0.152: v24.84,14.86 24.84,13.34 22.4,10.9 22.4,10.21 21.77,9.58 v21.77,9.37
  Bottom 0.152: J1.15 19.58,7.16 20.34,7.16 20.57,7.39 20.57,7.62 20.57,8.03 20.57,8.22 21.41,9.06 21.47,9.06 v21.78,9.37
  Bottom 0.203: 21.92,9.37 v21.78,9.37 v21.77,9.37
IO9  (via drill 0.35)
  Top 0.152: v17.98,20.65 21.26,20.65 22.17,19.74 22.17,19.43 IC1.17
  Bottom 0.152: v17.98,20.65 14.17,20.65 7.19,13.67 7.19,9.65 8.91,7.92 18.44,7.92 18.67,7.7 19.51,7.7 J1.17
IO10  (via drill 0.35)
  Top 0.152: IC1.18 20.95,17.22 17.6,13.87 17.6,13.72 v15.47,11.58
  Bottom 0.152: v15.47,11.58 15.47,11.35 18.67,8.15 J1.19
IO11  (via drill 0.35)
  Top 0.152: v19.66,18.06 19.66,19.36 IC1.19
  Bottom 0.152: v19.66,18.06 16.08,14.48 16.08,11.28 18.67,8.69 19.51,8.69 J1.21
IO12  (via drill 0.35)
  Top 0.152: v18.03,15.56 18.03,19.33 IC1.20
  Bottom 0.152: v18.03,15.56 17.62,15.56 16.38,14.33 16.38,11.49 18.73,9.14 18.75,9.14 J1.23
IO13  (via drill 0.35)
  Top 0.152: IC1.21 17.14,14.17 v16.99,14.02
  Bottom 0.152: J1.25 19.51,9.68 18.67,9.68 16.69,11.66 16.69,13.72 v16.98,14.02 v16.99,14.02
IO14  (via drill 0.35, 0.35 layers 15-16)
  Top 0.152: v16.54,15.85 16.54,18.44 15.93,19.05 15.93,19.36 IC1.22
  Route15 0.152: v17.68,14.71 v16.54,15.85
  Bottom 0.152: 19.51,10.13 J1.27 18.73,10.15 16.99,11.88 16.99,13.16 17.68,13.85 v17.68,14.71
IO15  (via drill 0.35)
  Top 0.152: IC1.8 26.43,10.39 v21.67,10.39
  Bottom 0.152: v21.67,10.39 21.43,10.62 19.55,10.62 J1.29
IO16  (via drill 0.35)
  Top 0.152: IC1.9 26.52,11.81 25.76,11.81 24.3,13.26 23.13,13.26 22.45,13.95 v21.51,13.95
  Bottom 0.152: J1.31 19.51,11.2 18.12,11.2 17.3,12.03 17.3,13.04 18.51,14.25 21.2,14.25 v21.51,13.95
IO17  (via drill 0.35)
  Top 0.152: 25.76,13.03 26.52,13.03 IC1.10 25.29,13.03 23.75,14.57 22.91,14.57 22.91,14.58 v22.88,14.58
  Bottom 0.152: J1.33 19.58,11.66 20.34,11.66 20.57,11.89 20.57,12.39 21.52,13.34 21.9,13.34 22.88,14.31 v22.88,14.58
IO18  (via drill 0.35)
  Top 0.152: IC1.11 26.59,14.33 26.82,14.33 27.58,15.09 27.58,18.59 27.36,18.82 25.68,18.82 25.45,18.59 25.45,18.52 23.85,16.92 23.45,16.92 23.09,16.56 23.09,15.72 22.09,14.72 21.21,14.72 20.04,13.54 18.91,13.54 18.17,12.8 v18.17,12.56
  Bottom 0.152: 19.52,12.12 J1.35 19.53,12.14 18.59,12.14 v18.17,12.56
N$1
  Top 0.152: R5.1 20.73,22.48 21.41,23.16 21.79,23.16 22.25,23.62 IC2.18
N$2  (via drill 0.35)
  Top 0.152: 3.81,16.77 3.81,17 | C2.2 2.16,18.18 R2.2 3.72,17.19 R8.2 3.81,16.92 v4.64,16.92 | IC3.8 3.81,14 v3.81,15
  Top 0.203: 3.81,17 R8.2
  Bottom 0.152: v3.81,15 3.81,15.58 4.53,16.3 4.53,16.8 v4.64,16.92
N$3
  Top 0.152: R7.1 23.24,22.48 | 23.24,22.48 R4.1 | 23.24,22.48 23.24,23.47 IC2.1
N$4
  Top 0.152: R3.2 21.34,23.77 21.64,23.77 21.95,24.08 22.25,24.08 IC2.17
N$5
  Top 0.152: 4.56,3.82 4.72,3.65 R9.2
  Top 0.203: 4.56,3.82 4.56,9.61 4.36,9.82 3.12,9.82 2.83,10.1 IC3.17
N$6
  Top 0.203: R10.2 6.03,9.15 5,10.17 3.58,10.17 3.33,10.42 IC3.18
N$7
  Top 0.152: D1.1 C11.1 5.92,22.3 J8.6 4.51,20.89 3.67,20.05 J8.7 J8.8 J8.9 2.02,27.42 2.54,27.94 2.43,28.05 J8.10 3.67,28.05 J8.11 | D1.1
  Top 0.203: R6.1 5.01,20.39 4.51,20.89
N$8
  Top 0.152: IC3.9 | IC3.9 3.33,14.53 3.08,14.78 3.05,14.78 2.73,15.11 R11.2
RXD0/SDA0  (via drill 0.3 layers 15-16, 0.35)
  Top 0.152: v10.36,6.71 9.07,6.71 IC1.36 8.99,6.63 6.55,6.63 5.94,6.02 I2C.1 6.03,6.06 R10.1
  Route15 0.152: v17.11,6.99 17.21,6.99 20.09,4.12 21.28,4.12 22.4,5.24 22.4,8.96 v24.5,11.06 24.52,11.08
  Bottom 0.152: J1.30 23.14,10.64 23.92,10.64 24.34,11.06 v24.5,11.06 | v17.11,6.99 10.65,6.99 v10.36,6.71
SCLK  (via drill 0.35)
  Top 0.152: IC1.35 9.07,8 13.94,8 17.34,11.4 21.61,11.4 v21.64,11.42
  Bottom 0.152: v21.64,11.42 21.86,11.2 23.09,11.2 J1.32
TXD0/SCL0  (via drill 0.3 layers 15-16, 0.35)
  Top 0.152: I2C.2 5.94,4.72 6.48,4.72 7.09,5.33 8.99,5.33 IC1.37 v10.43,5.41 v10.43,5.42 | 5.41,4.72 5.87,4.72 I2C.2 | 6.13,4.51 I2C.2 | R9.1 5.93,4.28 I2C.2
  Route15 0.152: v10.43,5.42 8.89,6.96 8.89,13.97 v11.43,16.51
  Bottom 0.152: J1.28 23.16,10.13 24.46,10.13 25.15,10.82 25.15,13.7 23.55,15.3 23.55,15.54 20.12,18.97 13.89,18.97 v11.43,16.51
USB_D+  (via drill 0.35)
  Top 0.152: J8.3 5.24,24.05 5.85,24.67 7.89,24.67 8.33,24.23 D1.2 8.33,24.73 v8.58,24.98 | v6.19,12.73 5.18,12.73 IC3.4
  Bottom 0.152: v8.58,24.98 7.56,23.96 7.56,19.09 6.36,17.89 6.36,17.04 6.49,16.92 6.49,13.03 v6.19,12.73 6.36,12.9
USB_D+/D8  (via drill 0.35)
  Top 0.152: v24.61,16.15 24.61,17.14 25.53,18.06 26.52,18.06 IC1.14
  Bottom 0.152: v24.61,16.15 24.61,16 25.45,15.16 25.45,9.14 24,7.7 23.16,7.7 J1.18
USB_D-  (via drill 0.35)
  Top 0.152: J8.2 5.24,24.71 5.57,25.03 7.73,25.03 8.33,25.63 D1.3 8.33,27.08 8.34,27.09 8.34,27.22 v8.32,27.23 | v5.88,13.79 5.69,13.6 5.69,13.32 5.54,13.18 IC3.5
  Bottom 0.152: v8.32,27.23 7.26,26.16 7.26,19.21 6.06,18.02 6.06,13.97 v5.88,13.79
USB_D-/D7  (via drill 0.35)
  Top 0.152: v25.22,16.84 26.52,16.84 IC1.13
  Bottom 0.152: v25.22,16.84 25.22,15.85 25.76,15.32 25.76,8.91 24,7.16 23.16,7.16 J1.16
VUSB  (via drill 0.35)
  Top 0.203: R2.1 4.18,18.61 v4.18,19.07 | D2.2 3.88,29.23 4.11,29 | D1.4 6.06,26.53 v6.06,27.27
  other vias: 5,29 5.02,29.92
  pour Route15 (no thermals): 4.86,31.32 4.87,31.31 4.86,26.34 5.53,25.67 5.53,18.95 4.31,17.73 3.43,17.73 3.43,18.67 3.81,19.05 3.85,28.4 3.19,29.06 3.19,31.32
  pour Route15 (no thermals): 4.57,27.96 6.36,27.96 7.02,27.3 7.02,25.59 6.82,25.4 4.47,25.43
  pour Top (no thermals): 3.81,25.78 3.81,25.17 3.84,25.14 5.24,25.14 5.58,25.48 6.61,25.48 6.86,25.73 6.86,26.58 6.52,26.92 6.52,27.22 6.18,27.56 5.93,27.56 5.69,27.32 5.69,26.08 5.41,25.79 3.8,25.79
  pour Top (no thermals): 5.08,31.23 3.41,31.23 3.25,31.06 3.25,29.32 4.08,28.49 5.37,28.49 5.37,28.97 5.36,31.22 5.08,31.22

### Text on the board
bNames: (c) 2022 e-Nable Italia / Alberto Navatta <alberto@e-nableitalia.it> / This schematic is licensed with a Creative Common Attribution- / NonCommercial-ShareAlike 4.0 International License | Controller Board - ESP32 Wroom - Rev. A